# Altium schematic sheet Sheet_2.SchDoc
size A4; SheetNumber: 2; SheetTotal: 3
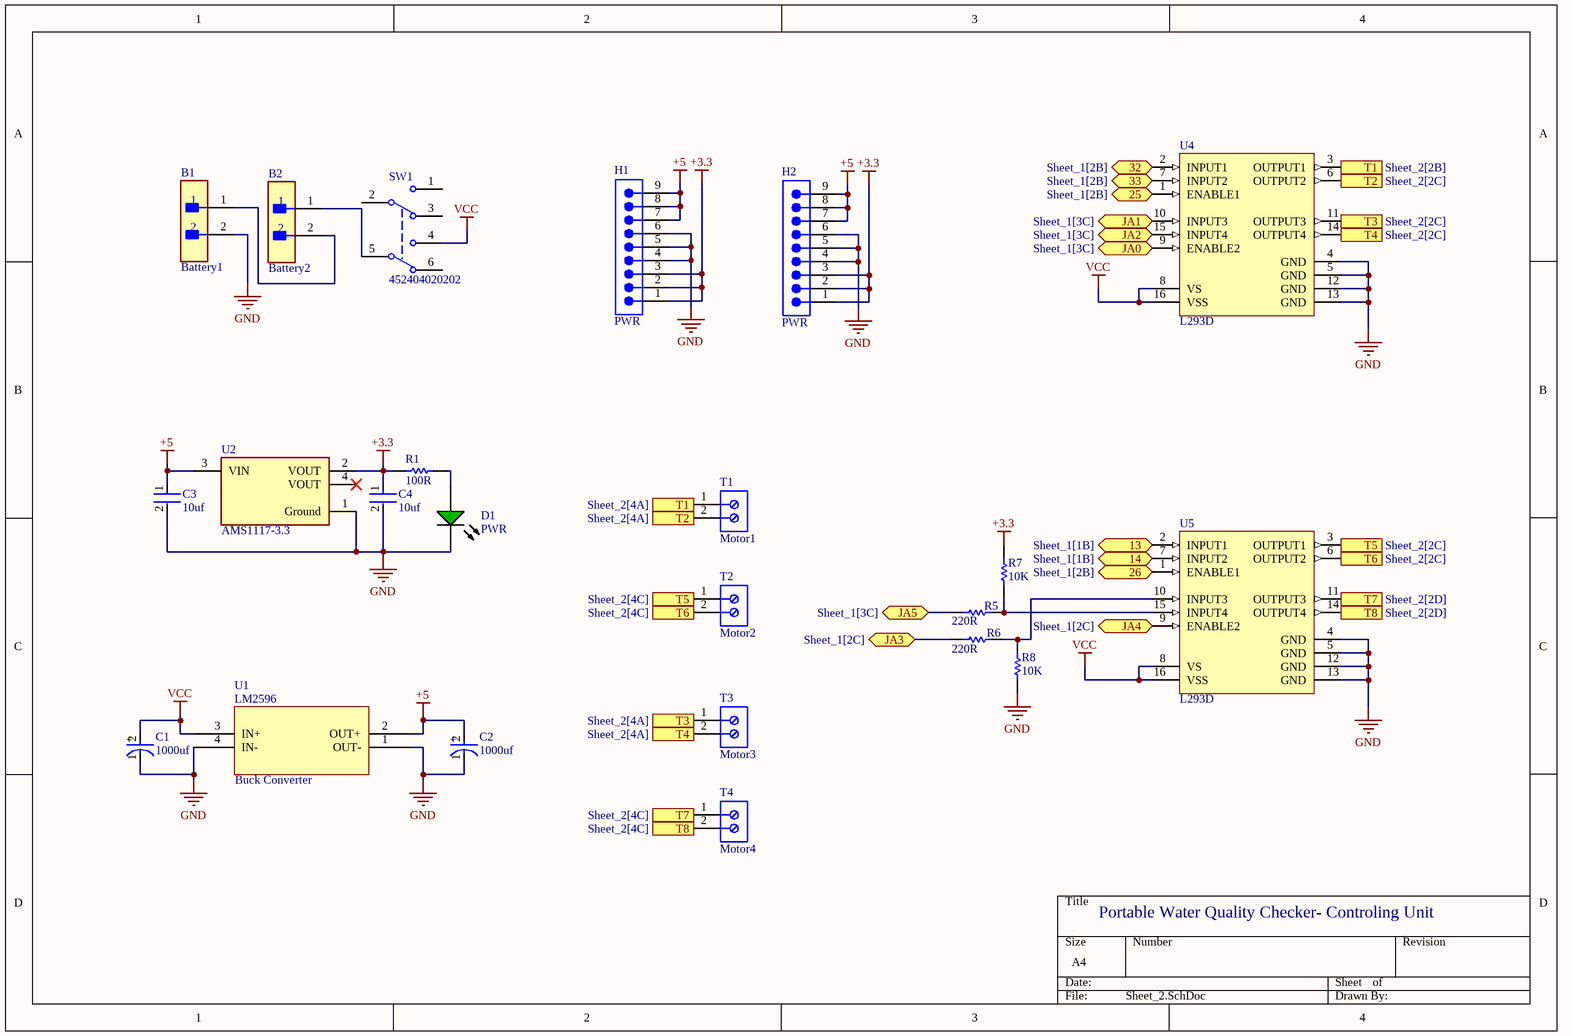
[diagram p0: Sheet_2.SchDoc]

## Parts
B1  Battery1  [FP-B2B-XH-AM_LF_SN-MFG]
B2  Battery2  [FP-B2B-XH-AM_LF_SN-MFG]
C1  1000uf  [FP-RAD-TH-D_10_0_5-L_16_1-MFG]
C2  1000uf  [FP-RAD-TH-D_10_0_5-L_16_1-MFG]
C3  10uf  [FP-GRM21B-0_1-MFG]
C4  10uf  [FP-GRM21B-0_1-MFG]
D1  PWR  [AVAG-HSMX-C170_V]
H1  PWR  [61300911121]
H2  PWR  [61300911121]
R1  100R  [RESC2013X70X40NL20T20]
R5  220R  [RESC2013X70X40NL20T20]
R6  220R  [RESC2013X70X40NL20T20]
R7  10K  [RESC2013X70X40NL20T20]
R8  10K  [RESC2013X70X40NL20T20]
SW1  452404020202  [452404020202]
T1  Motor1  [691214110002]
T2  Motor2  [691214110002]
T3  Motor3  [691214110002]
T4  Motor4  [691214110002]
U1  LM2596  [LM2596]  (value not drawn)
U2  AMS1117-3.3  [FP-AMS1117-IPC_A]
U4  L293D  [STM-L293D-16]
U5  L293D  [STM-L293D-16]

## Ports
13 (bidir, see Sheet_1[1B]), 14 (bidir, see Sheet_1[1B]), 25 (bidir, see Sheet_1[2B]), 26 (bidir, see Sheet_1[2B]), 32 (bidir, see Sheet_1[2B]), 33 (bidir, see Sheet_1[2B]), JA0 (bidir, see Sheet_1[3C]), JA1 (bidir, see Sheet_1[3C]), JA2 (bidir, see Sheet_1[3C]), JA3 (bidir, see Sheet_1[2C]), JA4 (bidir, see Sheet_1[2C]), JA5 (bidir, see Sheet_1[3C]), T1 (out, see Sheet_2[2B]), T1 (out, see Sheet_2[4A]), T2 (out, see Sheet_2[2C]), T2 (out, see Sheet_2[4A]), T3 (out, see Sheet_2[2C]), T3 (out, see Sheet_2[4A]), T4 (out, see Sheet_2[2C]), T4 (out, see Sheet_2[4A]), T5 (out, see Sheet_2[2C]), T5 (out, see Sheet_2[4C]), T6 (out, see Sheet_2[2C]), T6 (out, see Sheet_2[4C]), T7 (out, see Sheet_2[2D]), T7 (out, see Sheet_2[4C]), T8 (out, see Sheet_2[2D]), T8 (out, see Sheet_2[4C])

## Nets
+3.3: C4.1 H1.1 H1.2 H1.3 H2.1 H2.2 H2.3 R1.1 R7.2 U2.2(VOUT)
+5: C2.2(A) C3.1 H1.7 H1.8 H1.9 H2.7 H2.8 H2.9 U1.2(OUT+) U2.3(VIN)
GND: B1.2 C1.1(C) C2.1(C) C3.2 C4.2 D1.2(K) H1.4 H1.5 H1.6 H2.4 H2.5 H2.6 R8.1 U1.1(OUT-) U1.4(IN-) U2.1(Ground) U4.4(GND) U4.5(GND) U4.12(GND) U4.13(GND) U5.4(GND) U5.5(GND) U5.12(GND) U5.13(GND)
VCC: C1.2(A) SW1.4 U1.3(IN+) U4.8(VS) U4.16(VSS) U5.8(VS) U5.16(VSS)
13: U5.2(INPUT1) ; port 13
14: U5.7(INPUT2) ; port 14
25: U4.1(ENABLE1) ; port 25
26: U5.1(ENABLE1) ; port 26
32: U4.2(INPUT1) ; port 32
33: U4.7(INPUT2) ; port 33
JA0: U4.9(ENABLE2) ; port JA0
JA1: U4.10(INPUT3) ; port JA1
JA2: U4.15(INPUT4) ; port JA2
JA3: R6.1 ; port JA3
JA4: U5.9(ENABLE2) ; port JA4
JA5: R5.1 ; port JA5
T1: T1.1 U4.3(OUTPUT1) ; port T1
T2: T1.2 U4.6(OUTPUT2) ; port T2
T3: T3.1 U4.11(OUTPUT3) ; port T3
T4: T3.2 U4.14(OUTPUT4) ; port T4
T5: T2.1 U5.3(OUTPUT1) ; port T5
T6: T2.2 U5.6(OUTPUT2) ; port T6
T7: T4.1 U5.11(OUTPUT3) ; port T7
T8: T4.2 U5.14(OUTPUT4) ; port T8
NetB1_1: B1.1 B2.2
NetB2_1: B2.1 SW1.5
NetD1_1: D1.1(A) R1.2
NetR5_2: R5.2 R7.1 U5.15(INPUT4)
NetR6_2: R6.2 R8.2 U5.10(INPUT3)

Not connected (* = marked no-connect by the designer): SW1 1 2 3 6; U2 4(VOUT)*

## Notes on the sheet
- (near U1) Buck Converter
- Portable Water Quality Checker- Controling Unit
- (in symbol CMP-05427-001524-1) +

## Library data of the parts
B1 B2 = CMP-17439-000037-1: CONN HEADER VERT 2POS 2.5MM; Max Voltage Rating (AC): 250V; Connector Type: Male Pin; Contact Resistance: 20mR; Max Current Rating: 3A; Number of Positions: 2; Series: XH; Contact Material: Brass; Mount: Through Hole; Housing Material: Polyamide; Contact Plating: Tin; Termination: Solder; Max Operating Temperature: 85°C; Depth: 5.75mm; Packaging: Bulk; Min Operating Temperature: -25°C; Contact Type: Male Pin; Color: Green; Pitch: 2.5mm; Length: 7.4mm; Lead Free: Lead Free; Number of Rows: 1; Fastening Type: Detent; Housing Color: White; Orientation: Straight
C1 C2 = CMP-05427-001524-1: Aluminum Electrolytic Capacitors (Radial Lead Type) 1000uF ±20% 16V; Life (Hours): 2000Hour; Ripple Current (AC): 680mA; Polarity: Polar; Lead/Base Style: Straight; Lead Diameter: 0.6mm; Capacitance: 1mF; Leakage Current: 3uA; Dissipation Factor: 0.2%; Construction: RADIAL; Height: 16mm; Ripple Current: 680mA; Size: 16mm; Radiation Hardening: No; Min Operating Temperature: -40°C; Contact Plating: Tin; Mount: Through Hole; Termination: Radial; Width: 0inch; Max Operating Temperature: 85°C; RoHS Compliant: Yes; Length: 16mm; Voltage Rating: 16V; Lead Pitch: 5mm; Height - Seated (Max): 0.669inch; Voltage: 16V; Tolerance: 20%; Series: M; Packaging: Bulk; Package Quantity: 200; Number of Pins: 2; Case/Package: Radial; Diameter: 10mm; REACH SVHC: No SVHC; Voltage Rating (DC): 16V
C3 C4 = CMP-2007-03453-2: Chip Multilayer Ceramic Capacitors for General Purpose, 0805, 10uF, X5R, 15%, 10%, 16V; Radiation Hardening: No; Thickness: 0.053inch; Voltage Rating (DC): 16V; Lead Free: Lead Free; Package Quantity: 1; Width: 1.25mm; Case Code (Imperial): 0805; Depth: 1.25mm; Packaging: Tape and Reel; Dielectric: X5R; Max Operating Temperature: 85°C; Tolerance: 10%; Voltage Rating: 16V; Voltage: 16V; Capacitance: 10uF; Height: 1.25mm; Case Code (Metric): 2012; Material: Ceramic; Mount: Surface Mount; Case/Package: 0805; REACH SVHC: No SVHC; Length: 2mm; Min Operating Temperature: -55°C; Termination: SMD/SMT
D1 = CMP-2000-05062-1: Chip LED, Green, 2.2 V, -40 to 85 degC, 2-Pin SMD, Pb-Free, Tape and Reel; Manufacturer: Avago; No. of Pins: 2; Peak Wavelength: 570nm; SVHC: NoSVHC(16-Jun-2014); Dominant Wavelength: 572nm; Forward Current If: 20mA; Viewing Angle: 170deg; Lens Shape: Rectangular; PIV Max: 5V; External Width: 1.25mm; LED Type: Standard; External Depth: 0.8mm; Opto Mounting Orientation: Top; Luminous Intensity: 15mcd; Luminous Intensity Min: 4mcd; Forward Voltage VF Max: 2.6V; External Length / Height: 2mm; Bulb Size: 1.25mmx1.4mm; Light Area Height: 1mm; Voltage Vf Typ: 2.2V; Operating Temperature Max: 85degC; Datasheet Version: Oct-08; MSL: MSL2A-4weeks; Peak Forward Current: 20mA; Package Description: 2-Pin Surface Mount Device, Body 2 x 1.25 mm, Height 0.8 mm; Datasheet URL: https://datasheet.ciiva.com/29280/180495-da-01-en-chip-led-hsmg-c170-gelb-gruen-29280971.pdf; Storage Temperature Min: -40degC; LED Colour: Green; Wavelength Typ: 570nm; Mounting Type: SMD; Forward Current If Max: 20mA; Dominant Wavelength Typ: 572nm; LED Mounting: SMD; Operating Temperature Range: -30degCto+85degC; Operating Temperature Min: -30degC; Manufacturer URL: http://www.avagotech.com/; Packaging: CutTape; Luminous Intensity Typ: 15mcd; Package Reference: HSMX-C170; Storage Temperature Max: 85degC; Opto Case Style: SMD; Forward Voltage: 2.2V
H1 H2 = CMP-1502-01080-3: NexarPartId: 32855536; Current Rating: 3A; Connector Type: Male Pin; Operating Supply Voltage: 250V; Contact Resistance: 20mΩ; Pitch: 2.54mm; Number of Contacts: 9; Gender: Male; Lead Pitch: 2.54mm; REACH SVHC: Unknown; Number of Rows: 1; Mount: Through Hole; Contact Plating: Gold; Color: Black; Number of Pins: 9; Orientation: Vertical; Contact Material: Copper; Packaging: Bulk; Contact Mating Length: 5.9944mm; RoHS: Compliant; Number of Positions: 9; Termination: Solder
R1 R5 R6 = CMP-2001-00532-1: Manufacturer: Panasonic; Part Number: ERJ6ENF3300V
R7 R8 = CMP-2001-04376-1: Manufacturer: Panasonic; Part Number: ERJ-6ENF1002V
SW1 = CMP-03913-99472345-1: 452404020202 Slide Switch, Dpdt, 0.3A, 6Vdc, Tht Rohs Compliant: Yes |Wurth Elektronik 452404020202; Insulation Resistance: 100MΩ; Voltage Rating: 6V; Current Rating: 300mA; Min Operating Temperature: -40°C; Contact Plating: Silver; Max Operating Temperature: 85°C; Packaging: Bulk; NexarPartId: 99472345
T1-T4 = CMP-1502-02464-2: NexarPartId: 18818288; Plating: Brass, Steel; Current: 10A; Pitch: 3.5052mm; Number of Levels: 1; Number of Contacts: 2; Wire Gauge (Min): 16AWG; Voltage: 300V; Color: Blue, Green; Wire Gauge (Max): 24AWG; Stripping Length: -6mm; Number of Pins: 2; Number of Rows: 1; REACH SVHC: Unknown; RoHS: Compliant; Housing Material: Nylon; Termination: Screw; Mount: Through Hole; Contact Plating: Brass, Tin; Number of Positions Per Level: 2; Width: 7.9mm; Voltage Rating: 300V; Length: 7.4mm; Current Rating: 10A; Wire/Cable Gauge: 24AWG; Packaging: Box; Max Operating Temperature: 105°C; Lead Pitch: 3.5mm; Height: 8.7mm; Contact Material: Brass; Min Operating Temperature: -40°C
U2 = CMP-209535-000001-1: LDO Voltage Regulators 1A, 3.3V; Manufacturer: Advanced Monolithic Systems; Dropout Voltage: 1.1V; Output Type: Fixed; Nominal Supply Current: 5mA; Max Power Dissipation: 1.2W; Max Supply Voltage: 15V; Number Of Outputs: 1; Standoff Height: 0.64mm; Max Junction Temp: +125°C; Height: 1.8mm; Package: AMS1117; Device Class L2: Power Management ICs; ComponentLink2Description: Datasheet; ComponentLink2URL: http://www.advanced-monolithic.com/pdf/ds1117.pdf; Category: IC; RoHS: TRUE; Automotive: No; Device Class L1: Integrated Circuits (ICs); Output Current: 1A; Device Class L3: Voltage Regulators - Linear; Temperature: -40°C to +125°C; Output Voltage: 3.3V; Manufacturer Part Number: AMS1117-3.3; Temperature Range Low: -40°C; Octopart: https://octopart.com/ams1117-3.3-advanced+monolithic+systems-25899300; Lead Free: Yes; Ipc Land Pattern Name: SOT229P700X180-4; Temperature Range High: +125°C
U4 U5 = CMP-2000-06524-1: Push-Pull Four Channel Driver with Diode, 4.5 to 36 V, -40 to 150 degC, 16-Pin PDIP, RoHS, Tube; Manufacturer: STMicroelectronics; Number of Outputs: 4; Current - Peak Output: 1.2A; Current - Output / Channel: 600mA; Input Type: Non-Inverting; Other Related Documents: L293DViewAllSpecifications; Dynamic Catalog: HalfBridge; Voltage - Supply: 4.5V~36V; Other Names: 497-2936-5; Package / Case: 16-DIP(0.300",7.62mm); PartNumber: L293D; Operating Temperature: -40°C~150°C; Datasheet URL: http://www.st.com/st-web-ui/static/active/en/resource/technical/document/datasheet/CD00000059.pdf; Supplier Device Package: 16-PowerDIP; Packaging: Tube; Package Description: 16-Pin Thru-Hole Dual-In-Line, Body 20 x 6.85 mm, Pitch 2.54 mm; Standard Package: 25; Datasheet Version: 07/2003; On-State Resistance: -; Manufacturer URL: http://www.st.com/; Category: IntegratedCircuits(ICs); Family: PMIC-MOSFET,BridgeDrivers-InternalSwitch; Type: HalfBridge; Series: -; Mounting Technology: ThroughHole; Package Reference: DIP-16; Mounting Type: ThroughHole